# EAGLE design right thumb (EAGLE 9.4.2)
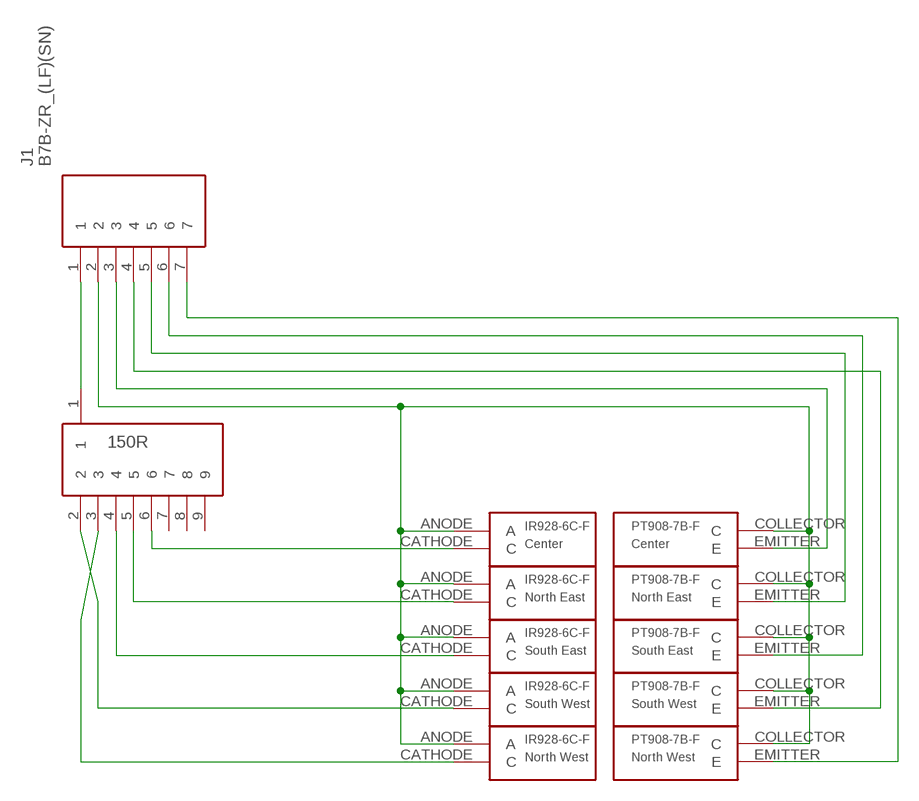
[diagram p0: schematic, sheet 1]

## Parts
J1  B7B-ZR_(LF)(SN)  [SHDR7W50P0X150_1X7_1200X350X45]
LED1  Center  IR928-6C-F  [IR928-6C-F]
LED2  North East  IR928-6C-F  [IR928-6C-F]
LED3  South East  IR928-6C-F  [IR928-6C-F]
LED4  South West  IR928-6C-F  [IR928-6C-F]
LED5  North West  IR928-6C-F  [IR928-6C-F]
PT1  Center  PT908-7B-F  [PT908-7B-F]
PT2  North East  PT908-7B-F  [PT908-7B-F]
PT3  South East  PT908-7B-F  [PT908-7B-F]
PT4  South West  PT908-7B-F  [PT908-7B-F]
PT5  North West  PT908-7B-F  [PT908-7B-F]
RN1  150R  9PIN-RESISTOR-NETWORK9PIN-RESISTOR-NETWORK  [9PIN-RESISTOR-NETWORK]

## Nets
N$1: J1.1 RN1.1
N$2: LED5.CATHODE(C) RN1.3
N$3: LED4.CATHODE(C) RN1.2
N$4: LED3.CATHODE(C) RN1.4
N$5: LED2.CATHODE(C) RN1.5
N$6: LED1.CATHODE(C) RN1.6
N$7: J1.2 LED1.ANODE(A) LED2.ANODE(A) LED3.ANODE(A) LED4.ANODE(A) LED5.ANODE(A) PT1.COLLECTOR(C) PT2.COLLECTOR(C) PT3.COLLECTOR(C) PT4.COLLECTOR(C) PT5.COLLECTOR(C)
N$8: J1.4 PT4.EMITTER(E)
N$9: J1.6 PT3.EMITTER(E)
N$10: J1.5 PT2.EMITTER(E)
N$11: J1.7 PT5.EMITTER(E)
N$12: J1.3 PT1.EMITTER(E)
Unconnected: RN1.7 RN1.8 RN1.9

## Library data of the parts
J1 = SamacSys_Parts:B7B-ZR_(LF)(SN): Connector,Multipole,PCB use,B7B-ZR (LF)( JST ZH Series, 1.5mm Pitch 7 Way 1 Row Straight PCB Header, Solder Termination, 1A Source: Datasheet <http://docs-emea.rs-online.com/webdocs/1147/0900766b81147f94.pdf>; DESCRIPTION: Connector,Multipole,PCB use,B7B-ZR (LF)( JST ZH Series, 1.5mm Pitch 7 Way 1 Row Straight PCB Header, Solder Termination, 1A; HEIGHT: 4.5mm; MANUFACTURER_NAME: JST (JAPAN SOLDERLESS TERMINALS); MANUFACTURER_PART_NUMBER: B7B-ZR (LF)(SN); RS_PART_NUMBER: 7620828; RS_PRICE-STOCK: https://uk.rs-online.com/web/p/products/7620828
LED1-LED5 = IR928-6C-F:IR928-6C-F
PT1-PT5 = PT908-7B-F:PT908-7B-F
RN1 = 9 pin resistor network:9PIN-RESISTOR-NETWORK: 9 pin, standard resistor network; HEIGHT: mm

## Board
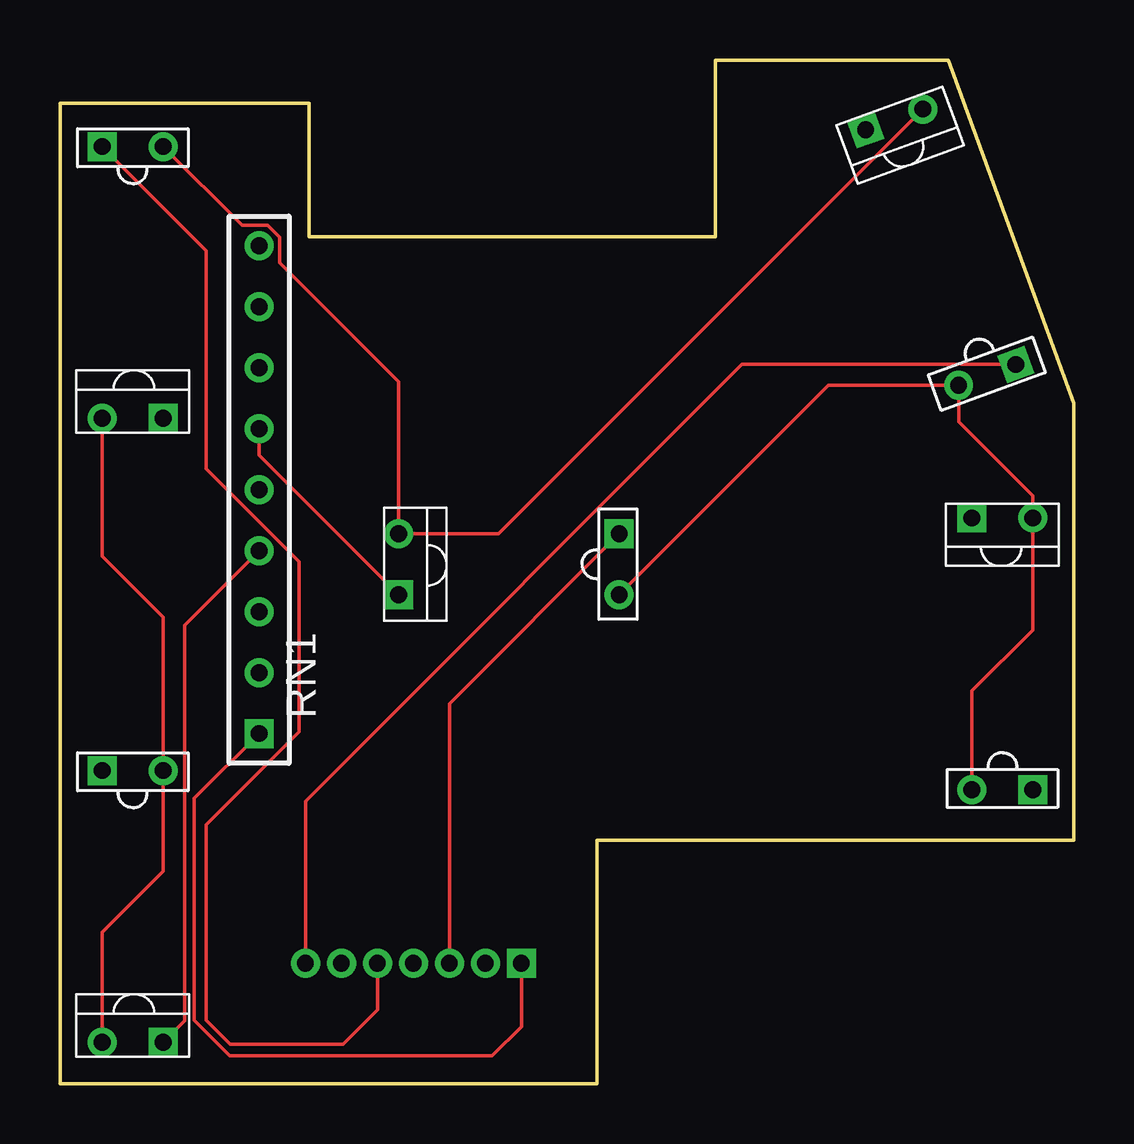
[diagram p1: board, top side]
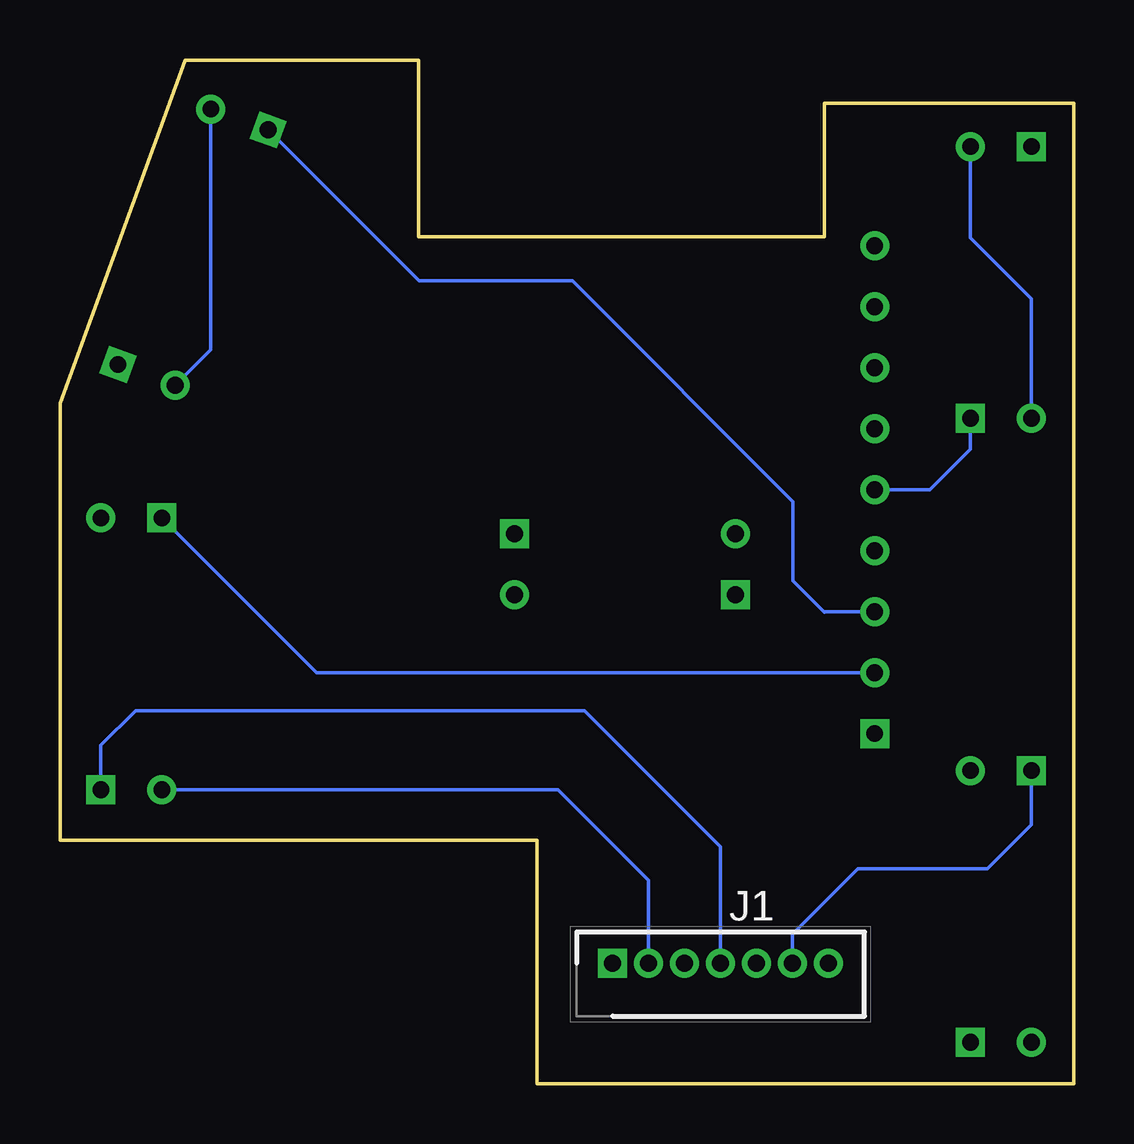
[diagram p2: board, bottom side, seen from below]

Size 42.26 x 42.66 mm. Coordinates in mm from the lower left corner, seen from the top.
Outline: 42.26,28.34 42.26,10.15 22.38,10.15 22.38,0 0,0 0,40.85 10.39,40.85 10.39,35.28 27.32,35.28 27.32,42.66 37.04,42.66 42.26,28.34
Copper layers (1*16): Top 0.035mm / dielectric 1.5mm / Bottom 0.035mm
Design rules "default": minimum track width 6mil, minimum drill 0.35mm, track to track 6mil, track to pad 6mil, pad to pad 6mil, via to via 6mil, smd to smd 6mil, copper to edge 40mil, drill to drill 6mil, minimum pad ring 10mil, minimum via ring 8mil, stop-mask expansion 4mil, vias tented up to drill 0mil, thermal gap 10mil

### Footprints (pad centres in the part's own frame; a part is rotated, then mirrored left to right if it is on the bottom)
SHDR7W50P0X150_1X7_1200X350X45 = drill 0.7 pad 1.1 square: 1 0,0 | drill 0.7 pad 1.1: 2 1.5,0; 3 3,0; 4 4.5,0; 5 6,0; 6 7.5,0; 7 9,0
IR928-6C-F = drill 0.7: ANODE 1.27,0 | drill 0.7 square: CATHODE -1.27,0
PT908-7B-F = drill 0.7: COLLECTOR 1.27,0 | drill 0.7 square: EMITTER -1.27,0
9PIN-RESISTOR-NETWORK = drill 0.7 square: 1 0,0 | drill 0.7: 2 2.54,0; 3 5.08,0; 4 7.62,0; 5 10.16,0; 6 12.7,0; 7 15.24,0; 8 17.78,0; 9 20.32,0

### Placement (x,y rotation side)
J1  19.23,5.02 0 bottom
LED1  14.11,21.65 90 top
LED2  3.03,27.73 180 top
LED3  3.03,1.73 180 top
LED4  39.28,23.57 0 top
LED5  34.78,40.18 20 top
PT1  23.31,21.65 270 top
PT2  3.03,39.05 0 top
PT3  3.03,13.05 0 top
PT4  39.28,12.25 180 top
PT5  38.65,29.54 200 top
RN1  8.3,14.59 90 top

### Tracks (layer width: path | path; a pad name or v marks a point on that pad's centre or on a via)
N$1
  Top 0.152: RN1.1 5.6,11.89 5.6,2.65 7.08,1.17 18.02,1.17 19.23,2.38 J1.1
N$2
  Top 0.152: 33.43,39.74 LED5.CATHODE
  Bottom 0.152: RN1.3 10.38,19.67 10.4,19.65 11.7,20.95 11.7,24.25 20.9,33.45 27.29,33.45 LED5.CATHODE
N$3
  Bottom 0.152: RN1.2 31.57,17.13 LED4.CATHODE
N$4
  Top 0.152: RN1.4 5.2,19.11 5.2,2.62 LED3.CATHODE
N$5
  Bottom 0.152: LED2.CATHODE 4.3,26.45 6,24.75 RN1.5
N$6
  Top 0.152: RN1.6 8.3,26.19 LED1.CATHODE
N$7
  Top 0.152: PT4.COLLECTOR 38.02,16.36 40.55,18.9 LED4.ANODE 40.55,24.49 37.46,27.59 PT5.COLLECTOR 32.03,29.1 PT1.COLLECTOR | LED5.ANODE 18.28,22.92 LED1.ANODE 14.11,29.24 9.16,34.2 9.16,35.27 8.65,35.77 7.59,35.77 PT2.COLLECTOR | LED3.ANODE 1.76,6.32 4.3,8.86 PT3.COLLECTOR 4.3,19.45 1.76,21.98 LED2.ANODE
  Bottom 0.152: J1.2 17.73,8.48 21.5,12.25 PT4.COLLECTOR | LED5.ANODE 35.97,30.59 PT5.COLLECTOR | PT2.COLLECTOR 4.3,35.25 1.76,32.71 LED2.ANODE
N$8
  Bottom 0.152: J1.4 14.73,9.88 20.4,15.55 39.1,15.55 40.55,14.1 PT4.EMITTER
N$9
  Bottom 0.152: PT3.EMITTER 1.76,10.79 3.6,8.95 9,8.95 11.73,6.22 J1.6
N$10
  Top 0.152: PT2.EMITTER 6.1,34.71 6.1,25.62 9.97,21.75 9.97,14.66 6.1,10.79 6.1,2.65 7.1,1.65 11.8,1.65 13.23,3.08 J1.5
N$11
  Top 0.152: J1.7 10.23,11.78 28.42,29.97 37.41,29.97 37.5,30 37.57,29.97 PT5.EMITTER
N$12
  Top 0.152: PT1.EMITTER 16.23,15.84 J1.3